# Altium project DynamicComplexModulo_v1i1.PrjPCB
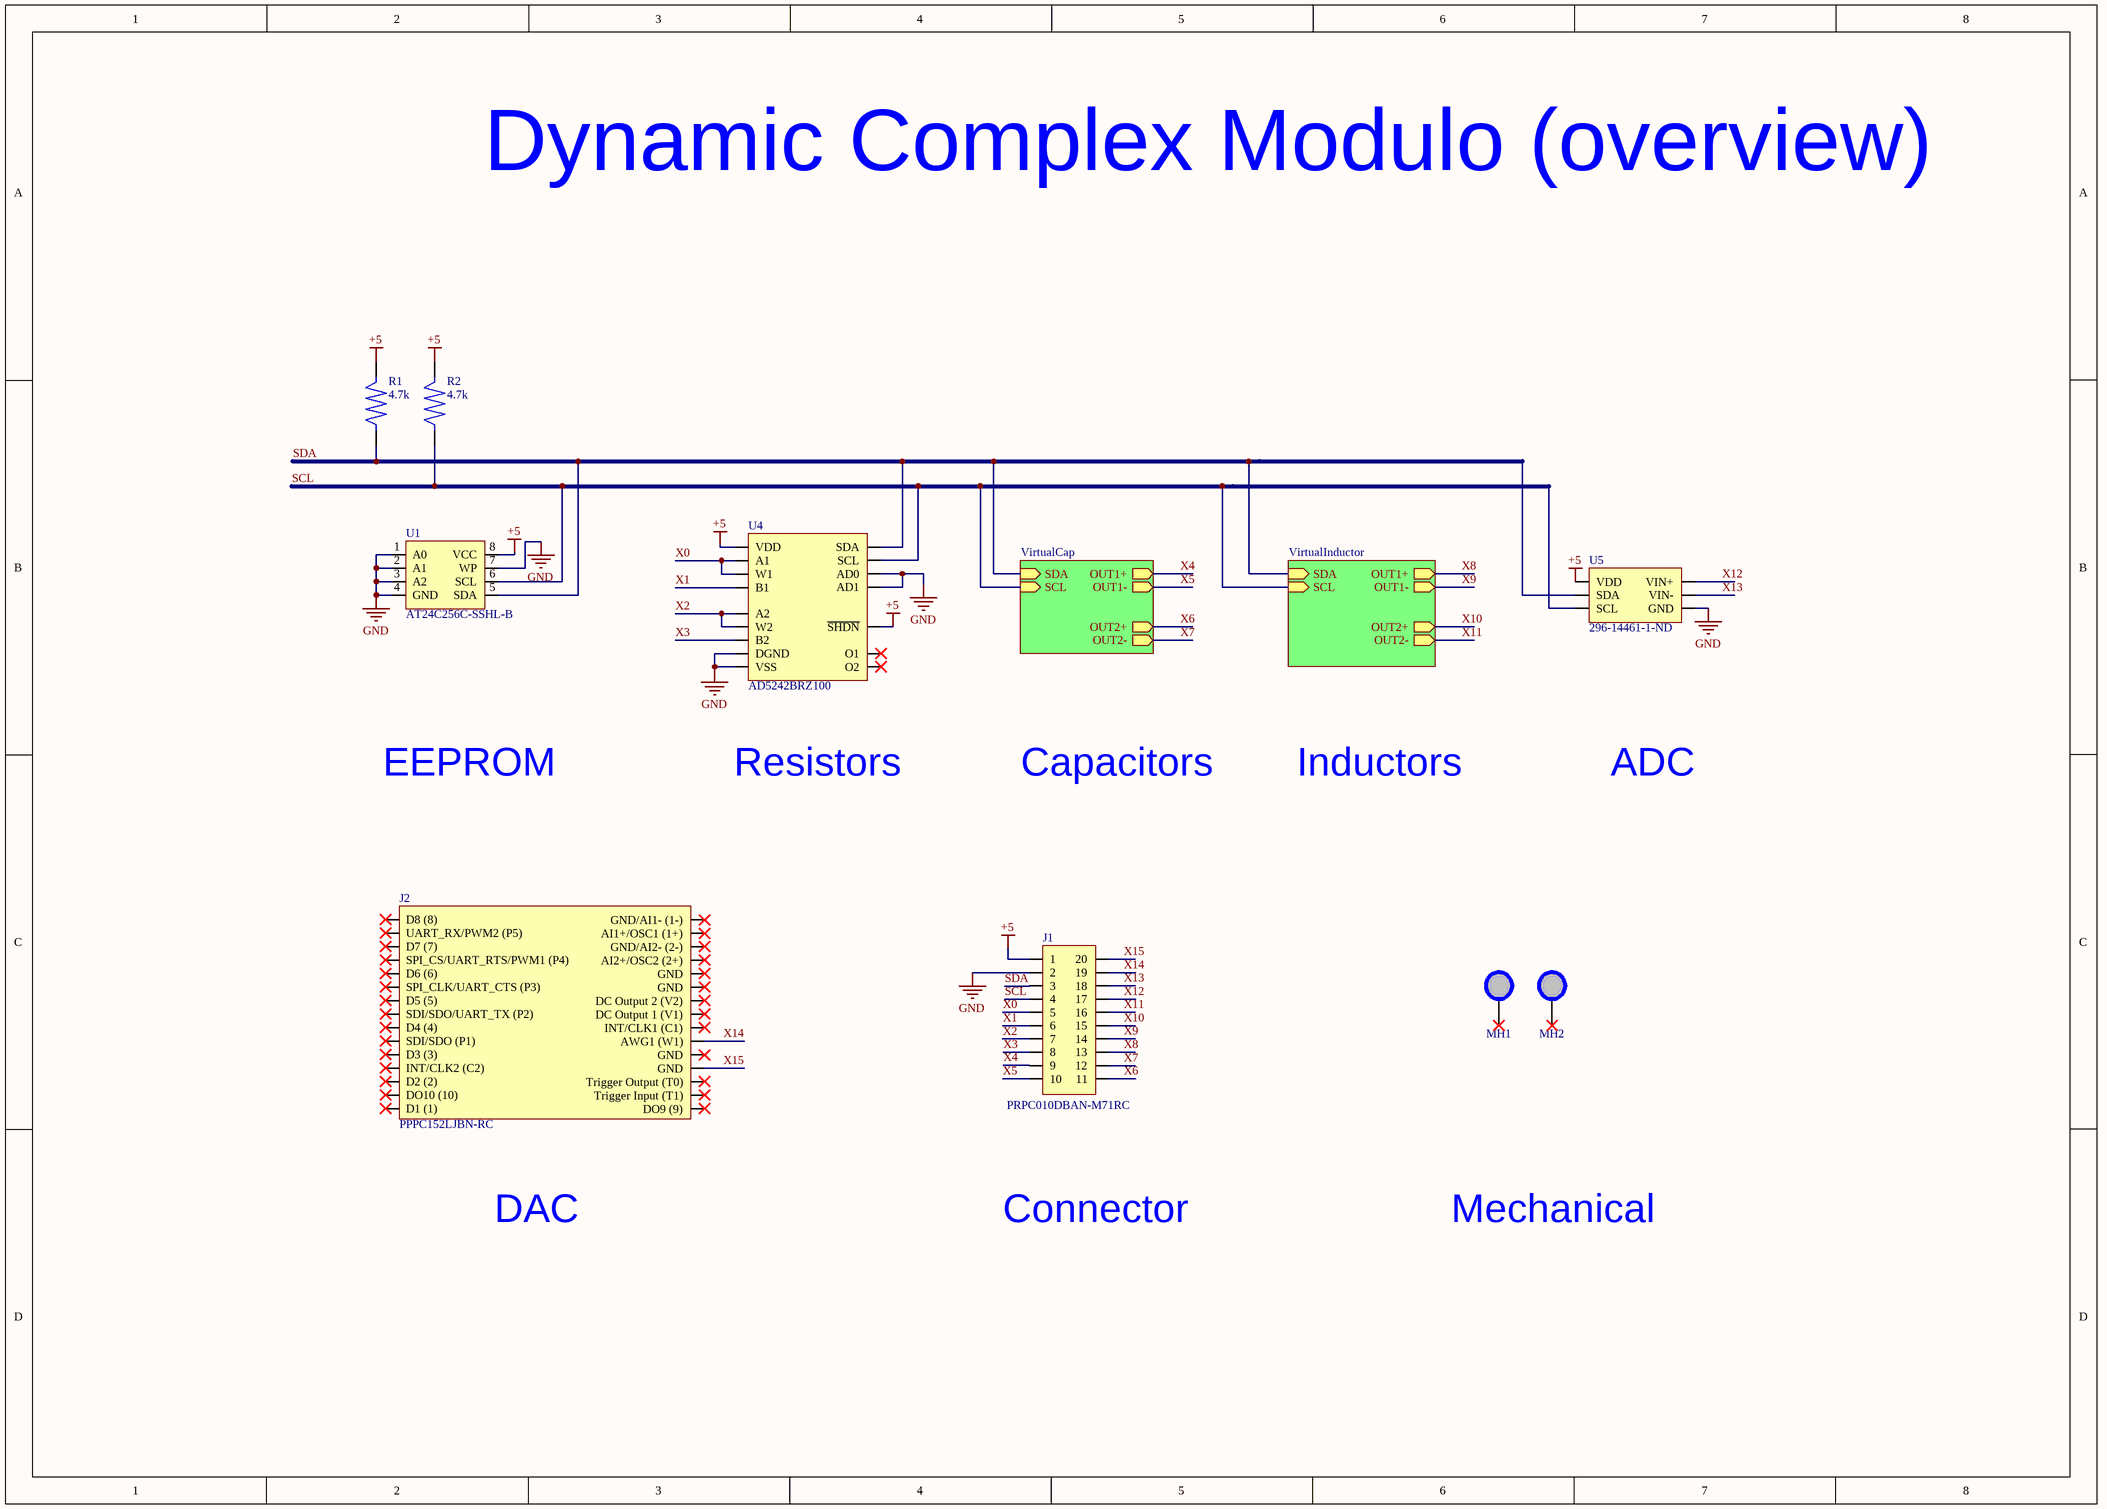
[diagram p0: DynamicComplexModulo_v1i1.SchDoc]
3 sheets, 45 parts. Net scope: hierarchical (ports join the sheet entries above them; power ports are global).
Board file: DynamicComplexModulo_v1i1.PcbDoc
Sheets:
  DynamicComplexModulo_v1i1.SchDoc
    VirtualCap = CapacitorLadder.SchDoc
    VirtualInductor = InductorLadder.SchDoc

## Sheet DynamicComplexModulo_v1i1.SchDoc
size A3

### Parts
J1  PRPC010DBAN-M71RC  [HDR_MALE_10x2x2.54]
J2  PPPC152LJBN-RC  [HDR_FEMALE_15x2x2.54]
MH1  MH 3.2mm NP  [MH3.2mm]  (value not drawn)  (no BOM)
MH2  MH 3.2mm NP  [MH3.2mm]  (value not drawn)  (no BOM)
R1  4.7k  [R0805]
R2  4.7k  [R0805]
U1  AT24C256C-SSHL-B  [AT24C256C-SSHL-B]
U4  AD5242BRZ100  [AD5242BRZ100]
U5  296-14461-1-ND  [SOT23-6]

### Sub-sheets
VirtualCap = CapacitorLadder.SchDoc: OUT1+ (out), OUT1- (out), OUT2+ (out), OUT2- (out), SDA (in), SCL (in)
VirtualInductor = InductorLadder.SchDoc: OUT1+ (out), OUT1- (out), OUT2+ (out), SDA (in), SCL (in), OUT2- (out)

### Nets
+5: J1.1 R1.2 R2.2 U1.8(VCC) U4.5(VDD) U4.6(~{SHDN}) U5.5(VDD)
GND: J1.2 U1.1(A0) U1.2(A1) U1.3(A2) U1.4(GND) U1.7(WP) U4.9(AD0) U4.10(AD1) U4.11(DGND) U4.12(VSS) U5.2(GND)
SCL: J1.4 R2.1 U1.6(SCL) U4.7(SCL) U5.3(SCL) ; sheet VirtualCap/SCL, sheet VirtualInductor/SCL
SDA: J1.3 R1.1 U1.5(SDA) U4.8(SDA) U5.4(SDA) ; sheet VirtualCap/SDA, sheet VirtualInductor/SDA
X0: J1.5 U4.2(A1) U4.3(W1)
X1: J1.6 U4.4(B1)
X2: J1.7 U4.15(W2) U4.16(A2)
X3: J1.8 U4.14(B2)
X4: J1.9 ; sheet VirtualCap/OUT1+
X5: J1.10 ; sheet VirtualCap/OUT1-
X6: J1.11 ; sheet VirtualCap/OUT2+
X7: J1.12 ; sheet VirtualCap/OUT2-
X8: J1.13 ; sheet VirtualInductor/OUT1+
X9: J1.14 ; sheet VirtualInductor/OUT1-
X10: J1.15 ; sheet VirtualInductor/OUT2+
X11: J1.16 ; sheet VirtualInductor/OUT2-
X12: J1.17 U5.1(VIN+)
X13: J1.18 U5.6(VIN-)
X14: J1.19 J2.21(AWG1_(W1))
X15: J1.20 J2.19(GND)

Not connected (* = marked no-connect by the designer): J2 1(D8_(8))* 2(UART_RX/PWM2_(P5))* 3(D7_(7))* 4(SPI_CS/UART_RTS/PWM1_(P4))* 5(D6_(6))* 6(SPI_CLK/UART_CTS_(P3))* 7(D5_(5))* 8(SDI/SDO/UART_TX_(P2))* 9(D4_(4))* 10(SDI/SDO_(P1))* 11(D3_(3))* 12(INT/CLK2_(C2))* 13(D2_(2))* 14(DO10_(10))* 15(D1_(1))* 16(DO9_(9))* 17(Trigger_Input_(T1))* 18(Trigger_Output_(T0))* 20(GND)* 22(INT/CLK1_(C1))* 23(DC_Output_1_(V1))* 24(DC_Output_2_(V2))* 25(GND)* 26(GND)* 27(AI2+/OSC2_(2+))* 28(GND/AI2-_(2-))* 29(AI1+/OSC1_(1+))* 30(GND/AI1-_(1-))*; MH1 1*; MH2 1*; U4 1(O1)* 13(O2)*

### Notes on the sheet
- Dynamic Complex Modulo (overview)
- EEPROM
- Resistors
- Capacitors
- Inductors
- ADC
- DAC
- Connector
- Mechanical

### Library data of the parts
J1 = HDR Male 2x10_2.54: 20 Positions Header, Unshrouded, Breakaway Connector 0.100" (2.54mm) Through Hole, Right Angle Gold; Manufacturer: Sullins; Number of Positions: 20; Connector Type: Male Pin; Pitch: 0.1inch; Supplier 1: Digi-Key; Manufacturer Part Number: PRPC010DBAN-M71RC; Stock 1: 459; Mount: Through Hole; Colour: Black; Contact Plating: Gold; Package Quantity: 1; Number of Rows: 2; Packaging: Bulk; Termination: Solder; Row Spacing: 0.1inch; Contact Mating Length: 0.23inch; ComponentLink1URL: https://datasheet.ciiva.com/741/xrxczzzdxxn-m71rc-11639-b-741675.pdf; ComponentLink1Description: https://datasheet.ciiva.com/741/xrxczzzdxxn-m71rc-11639-b-741675.pdf; Supplier Part Number 1: S2111EC-10-ND; Pricing 1: 1=1.08, 10=0.97, 100=0.7989, 500=0.6315, 1000=0.5421, 5000=0.49455, 10000=0.47553 (USD); System: Connector
J2 = OPENSCOPE_CONNECTOR: CONN FMALE 30POS DL .1" R/A GOLD; Manufacturer: Sullins; Number of Positions: 30; Connector Type: Socket,Header; Pitch: 0.1inch; Supplier 1: Digi-Key; Manufacturer Part Number: PPPC152LJBN-RC; Stock 1: 2029; Mount: Through Hole; Colour: Black; Contact Plating: Gold; Contact Material: Bronze; Housing Colour: Black; Housing Material: Plastic; Package Quantity: 1000; Number of Rows: 2; Packaging: Bulk; Termination: Solder; Length: 38.6mm; Height: 5mm; Row Spacing: 0.1inch; Width: 8.5mm; Lead Free: Lead Free; ComponentLink1URL: http://sullinscorp.com/drawings/101_P(N)PxCxx2LJBN-RC,_10494-H.pdf; ComponentLink1Description: http://sullinscorp.com/drawings/101_P(N)PxCxx2LJBN-RC,_10494-H.pdf; Supplier Part Number 1: S5568-ND; Pricing 1: 1=2.22, 10=2.018, 100=1.7294, 500=1.44112, 1000=1.23525, 5000=1.1895 (USD)
MH1 MH2 = MHNP: Mounting hole 3.2mm non plated
R1 R2 = R0805_4.7k
U1 = AT24C256C-SSHL-B: ATMEL         AT24C256C-SSHL-B            EEPROM, 256 Kbit, 32K x 8bit, 1 MHz, Serial, SOIC, 8 Pins; Manufacturer: Microchip / Atmel; Interface: I2C,Serial,2-Wire; Min Supply Voltage: 1.7V; Max Supply Voltage: 5.5V; Access Time: 550ns; Number of Words: 32768; Density: 256Kb; Frequency: 1MHz; Nominal Supply Current: 3mA; Voltage: 5V; Supplier 1: Digi-Key; Manufacturer Part Number: AT24C256C-SSHL-B; Stock 1: 4655; Mount: Surface Mount; Case/Package: SOIC; Number of Pins: 8; Contact Plating: Tin,Matte; Min Operating Temperature: -40°C; Max Operating Temperature: 85°C; Packaging: Bulk; Package Quantity: 100; Memory Type: EEPROM; Memory Size: 256Kb; Max Frequency: 1MHz; Length: 5.05mm; Height: 1.5mm; Width: 3.99mm; Radiation Hardening: No; REACH SVHC: No SVHC; ComponentLink1URL: https://datasheet.ciiva.com/15123/getdatasheetpartid-367456-15123424.pdf; ComponentLink1Description: https://datasheet.ciiva.com/15123/getdatasheetpartid-367456-15123424.pdf; ComponentLink2URL: https://datasheet.ciiva.com/15123/getdatasheetpartid-304516-15123348.pdf; ComponentLink2Description: https://datasheet.ciiva.com/15123/getdatasheetpartid-304516-15123348.pdf; ComponentLink3URL: https://datasheet.ciiva.com/1910/atmel-8568-seeprom-at24c256c-datasheet-1910422.pdf; ComponentLink3Description: https://datasheet.ciiva.com/1910/atmel-8568-seeprom-at24c256c-datasheet-1910422.pdf; ComponentLink4URL: https://datasheet.ciiva.com/1509/1726561-1509879.pdf; ComponentLink4Description: https://datasheet.ciiva.com/1509/1726561-1509879.pdf; Supplier Part Number 1: AT24C256C-SSHL-B-ND; Pricing 1: 1=0.68, 10=0.619, 25=0.6108, 100=0.543 (USD)
U4 = AD5242BRZ100-REEL7: IC POT DGTL DUAL 256POS 16SOIC; Manufacturer: Analog Devices; Resistance: 100kR; Interface: I2C; Max Supply Voltage: 5.5V; Min Supply Voltage: 2.7V; Min Dual Supply Voltage: 2.3V; Tolerance: 50%; Nominal Supply Current: 100nA; Dual Supply Voltage: 2.5V; Number of Circuits: 2; Number of Taps: 256; Memory Type: Volatile; Temperature Coefficient: 30ppm/°C; Frequency: 400kHz; -3db Bandwidth: 650kHz; Supplier 1: Digi-Key; Manufacturer Part Number: AD5242BRZ100-REEL7; Stock 1: 881; Mount: Surface Mount; Case/Package: SOIC; Number of Pins: 16; Contact Plating: Tin,Matte; Min Operating Temperature: -40°C; Max Operating Temperature: 105°C; Packaging: Tape and Reel; Max Dual Supply Voltage: 2.7V; Package Quantity: 1000; Taper: Linear; Operating Supply Current: 100nA; Number of Positions: 256; Number of Elements: 2; Max Supply Current: 100nA; Quiescent Current: 100nA; Lead Free: Contains Lead; ComponentLink1URL: https://datasheet.ciiva.com/3046/ad5241-5242-3046354.pdf; ComponentLink1Description: https://datasheet.ciiva.com/3046/ad5241-5242-3046354.pdf; ComponentLink2URL: https://datasheet.ciiva.com/1339/ad5241-5242-1339036.pdf; ComponentLink2Description: https://datasheet.ciiva.com/1339/ad5241-5242-1339036.pdf
U5 = ADS1110A7IDBVT: IC ADC 16-BIT I2C PROGBL SOT23-6; Manufacturer: Texas Instruments; Min Supply Voltage: 2.7V; Max Supply Voltage: 5.5V; Number of Channels: 1; Max Power Dissipation: 1.75mW; Operating Supply Voltage: 5V; Number of Bits: 16; Sampling Rate: 0.128KS/s; Resolution: 16b; Polarity: Bipolar,Unipolar; Differential Nonlinearity: 1LSB; Conversion Rate: 128S/s; Nominal Supply Current: 240uA; Supply Type: Single; Supplier 1: Digi-Key; Manufacturer Part Number: ADS1110A7IDBVT; Stock 1: 469; Case/Package: SOT-23-6; Number of Pins: 6; Contact Plating: Gold; Min Operating Temperature: -40°C; Max Operating Temperature: 125°C; Packaging: Tape and Reel; Package Quantity: 250; Interface: I2C; Number of Inputs: 1; Number of A/D Converters: 1; Number of Converters: 1; Number of Elements: 1; Power Dissipation: 1.75mW; Number of Analog Inputs: 1; Radiation Hardening: No; Lead Free: Lead Free; ComponentLink1URL: https://datasheet.ciiva.com/25993/ads1110-25993414.pdf; ComponentLink1Description: https://datasheet.ciiva.com/25993/ads1110-25993414.pdf; ComponentLink2URL: https://datasheet.ciiva.com/1262/ads1110-1262313.pdf; ComponentLink2Description: https://datasheet.ciiva.com/1262/ads1110-1262313.pdf; ComponentLink3URL: https://datasheet.ciiva.com/1262/ads1110-1262314.pdf; ComponentLink3Description: https://datasheet.ciiva.com/1262/ads1110-1262314.pdf; ComponentLink4URL: https://datasheet.ciiva.com/1262/ads1110-1262315.pdf; ComponentLink4Description: https://datasheet.ciiva.com/1262/ads1110-1262315.pdf; ComponentLink5URL: https://datasheet.ciiva.com/14260/sbas276a-14260046.pdf; ComponentLink5Description: https://datasheet.ciiva.com/14260/sbas276a-14260046.pdf; ComponentLink6URL: https://datasheet.ciiva.com/26800/ads1110a7idbvt-26800806.pdf; ComponentLink6Description: https://datasheet.ciiva.com/26800/ads1110a7idbvt-26800806.pdf; ComponentLink7URL: https://datasheet.ciiva.com/41461/001186690-da-01-en-ic-adc-16-bi-ads1110a7idbvt-sot-23-6-tid-41461014.pdf; ComponentLink7Description: https://datasheet.ciiva.com/41461/001186690-da-01-en-ic-adc-16-bi-ads1110a7idbvt-sot-23-6-tid-41461014.pdf; Supplier Part Number 1: 296-14468-6-ND; Pricing 1: 1=6.46, 10=5.805, 100=4.7561 (USD); Mount: Surface Mount

## Sheet CapacitorLadder.SchDoc
size A4
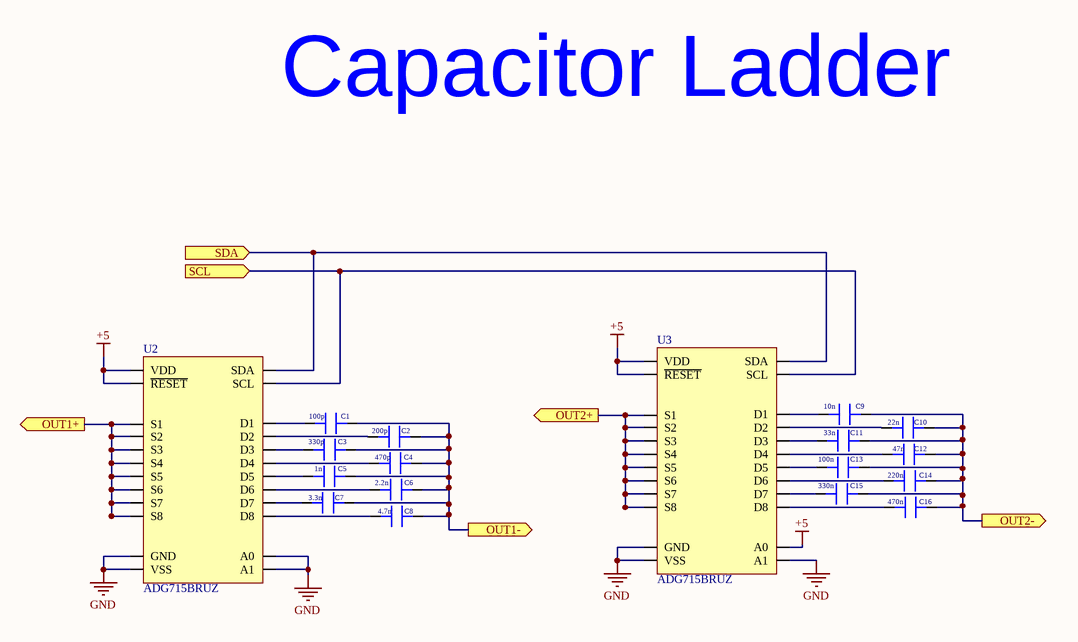
[diagram p1: CapacitorLadder.SchDoc]

### Parts
C1  100p  [C0805]
C2  200p  [C0805]
C3  330p  [C0805]
C4  470p  [C0805]
C5  1n  [C0805]
C6  2.2n  [C0805]
C7  3.3n  [C0805]
C8  4.7n  [C0805]
C9  10n  [C0805]
C10  22n  [C0805]
C11  33n  [C0805]
C12  47n  [C0805]
C13  100n  [C0805]
C14  220n  [C0805]
C15  330n  [C0805]
C16  470n  [C0805]
U2  ADG715BRUZ  [ADG715BRUZ]
U3  ADG715BRUZ  [ADG715BRUZ]

### Ports
OUT1+ (out), OUT1- (out), OUT2+ (out), OUT2- (out), SCL (in), SDA (in)

### Nets
+5: U2.2(VDD) U2.23(~{RESET}) U3.2(VDD) U3.23(~{RESET}) U3.24(A0)
GND: U2.4(GND) U2.21(VSS) U2.22(A1) U2.24(A0) U3.4(GND) U3.21(VSS) U3.22(A1)
SCL: U2.1(SCL) U3.1(SCL) ; port SCL
SDA: U2.3(SDA) U3.3(SDA) ; port SDA
X4: U2.5(S1) U2.7(S2) U2.9(S3) U2.11(S4) U2.14(S5) U2.16(S6) U2.18(S7) U2.20(S8) ; port OUT1+
X5: C1.2 C2.2 C3.2 C4.2 C5.2 C6.2 C7.2 C8.2 ; port OUT1-
X6: U3.5(S1) U3.7(S2) U3.9(S3) U3.11(S4) U3.14(S5) U3.16(S6) U3.18(S7) U3.20(S8) ; port OUT2+
X7: C9.2 C10.2 C11.2 C12.2 C13.2 C14.2 C15.2 C16.2 ; port OUT2-
NetC1_1: C1.1 U2.6(D1)
NetC2_1: C2.1 U2.8(D2)
NetC3_1: C3.1 U2.10(D3)
NetC4_1: C4.1 U2.12(D4)
NetC5_1: C5.1 U2.13(D5)
NetC6_1: C6.1 U2.15(D6)
NetC7_1: C7.1 U2.17(D7)
NetC8_1: C8.1 U2.19(D8)
NetC9_1: C9.1 U3.6(D1)
NetC10_1: C10.1 U3.8(D2)
NetC11_1: C11.1 U3.10(D3)
NetC12_1: C12.1 U3.12(D4)
NetC13_1: C13.1 U3.13(D5)
NetC14_1: C14.1 U3.15(D6)
NetC15_1: C15.1 U3.17(D7)
NetC16_1: C16.1 U3.19(D8)

### Notes on the sheet
- Capacitor Ladder
- Title
- Size:
- Date:
- A4
- Number:
- Time:
- Revision:
- Sheet
- of
- File:

### Library data of the parts
C1 = C805_100p
C2 = C805_200p
C3 = C805_330p
C4 = C805_470p
C5 = C805_1n
C6 = C805_2.2n
C7 = C805_3.3n
C8 = C805_4.7n
C9 = C805_10n
C10 = C805_22n
C11 = C805_33n
C12 = C805_47n
C13 = C805_100n
C14 = C805_220n
C15 = C805_330n
C16 = C805_470n
U2 U3 = ADG715BRUZ: ANALOG DEVICES         ADG715BRUZ            Analogue Switch, Octal Channel, SPST, 8 Channels, 4.5 ohm, 2.7V to 5.5V, TSSOP, 24 Pins; Number of Channels: 8; Bandwidth: 155MHz; Drain to Source Resistance: 2.5R; Nominal Supply Current: 20uA; Max Power Dissipation: 125uW; Interface: Serial; Dual Supply Voltage: 2.5V; On-State Resistance: 4.5R; Turn-On Delay Time: 140ns; Turn-Off Delay Time: 130ns; Operating Supply Current: 10uA; High Level Output Current: 30mA; Supply Type: Single,Dual; Max Dual Supply Voltage: 2.75V; Min Dual Supply Voltage: 2.25V; Supplier 1: Digi-Key; Manufacturer: Analog Devices; Manufacturer Part Number: ADG715BRUZ; Stock 1: 3027; Case/Package: TSSOP; Number of Pins: 24; Contact Plating: Tin,Matte; Min Operating Temperature: -40°C; Max Operating Temperature: 85°C; Throw Configuration: SPST; Number of Bits: 8; Min Supply Voltage: 2.7V; Max Supply Voltage: 5.5V; Number of Inputs: 8; Number of Outputs: 8; Package Quantity: 62; Packaging: Rail/Tube; Number of Circuits: 8; -3db Bandwidth: 155MHz; Max Supply Current: 20uA; Power Dissipation: 125uW; Length: 7.8mm; Height: 1.05mm; Width: 4.4mm; Radiation Hardening: No; REACH SVHC: No SVHC; Lead Free: Contains Lead; ComponentLink1URL: https://datasheet.ciiva.com/2978/adg714-715-2978656.pdf; ComponentLink1Description: https://datasheet.ciiva.com/2978/adg714-715-2978656.pdf; ComponentLink2URL: https://datasheet.ciiva.com/1668/adg714-715-1668978.pdf; ComponentLink2Description: https://datasheet.ciiva.com/1668/adg714-715-1668978.pdf; ComponentLink3URL: https://datasheet.ciiva.com/15127/getdatasheetpartid-123058-15127194.pdf; ComponentLink3Description: https://datasheet.ciiva.com/15127/getdatasheetpartid-123058-15127194.pdf; ComponentLink4URL: https://datasheet.ciiva.com/16637/adg714-715-16637994.pdf; ComponentLink4Description: https://datasheet.ciiva.com/16637/adg714-715-16637994.pdf; ComponentLink5URL: https://datasheet.ciiva.com/5797/adg714-715-5797179.pdf; ComponentLink5Description: https://datasheet.ciiva.com/5797/adg714-715-5797179.pdf; ComponentLink6URL: https://datasheet.ciiva.com/48708/001248020-da-01-en-ic-switch-octal-adg715bruz-tssop-24-adi-48708535.pdf; ComponentLink6Description: https://datasheet.ciiva.com/48708/001248020-da-01-en-ic-switch-octal-adg715bruz-tssop-24-adi-48708535.pdf; Supplier Part Number 1: ADG715BRUZ-ND; Pricing 1: 1=6.12, 62=5.19758, 124=4.50452, 558=3.83461, 1054=3.234 (USD)

## Sheet InductorLadder.SchDoc
size A4
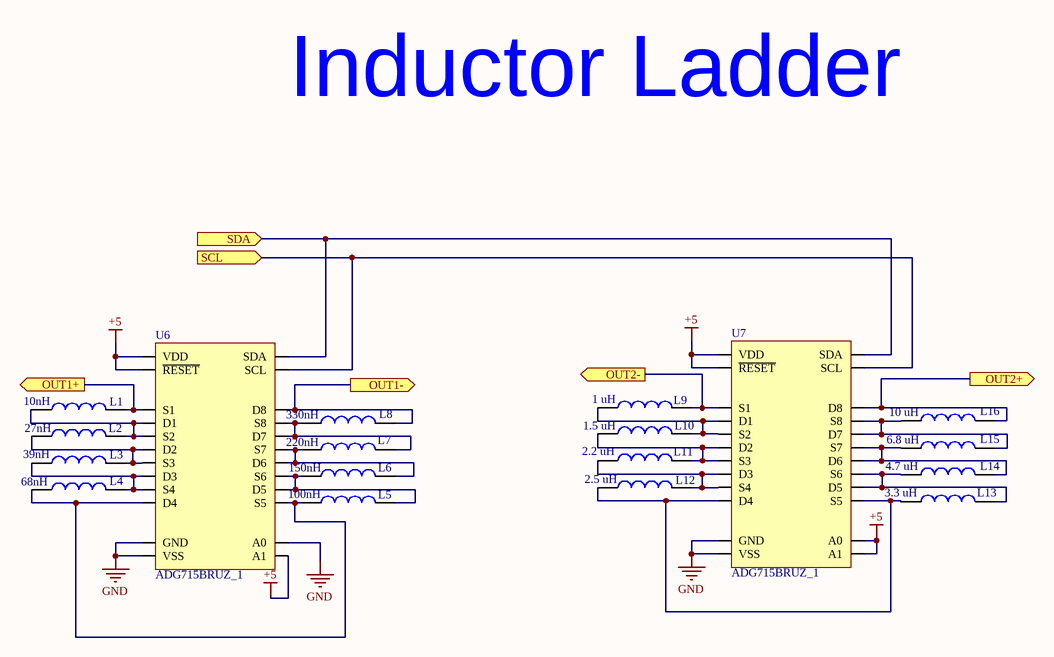
[diagram p2: InductorLadder.SchDoc]

### Parts
L1  value 10nH  [WE-KI_1008A]  (hidden comment: WE-KI, 744762110A)
L2  value 27nH  [WE-KI_1008A]  (hidden comment: WE-KI, 744762127A)
L3  value 39nH  [WE-KI_1008A]  (hidden comment: WE-KI, 744762139A)
L4  value 68nH  [WE-KI_1008A]  (hidden comment: WE-KI, 744762168A)
L5  value 100nH  [WE-KI_1008A]  (hidden comment: WE-KI, 744762210A)
L6  value 150nH  [WE-KI_1008A]  (hidden comment: WE-KI, 744762215A)
L7  value 220nH  [WE-KI_1008A]  (hidden comment: WE-KI, 744762222A)
L8  value 330nH  [WE-KI_1008A]  (hidden comment: WE-KI, 744762233A)
L9  1 uH  [WE-LQS_2010]
L10  1.5 uH  [WE-LQS_2010]
L11  2.2 uH  [WE-LQS_2010]
L12  2.5 uH  [WE-LQS_2010]
L13  3.3 uH  [WE-LQS_2010]
L14  4.7 uH  [WE-LQS_2010]
L15  6.8 uH  [WE-LQS_2010]
L16  10 uH  [WE-LQS_2010]
U6  ADG715BRUZ_1  [ADG715BRUZ]
U7  ADG715BRUZ_1  [ADG715BRUZ]

### Ports
OUT1+ (out), OUT1- (out), OUT2+ (out), OUT2- (out), SCL (in), SDA (in)

### Nets
+5: U6.2(VDD) U6.22(A1) U6.23(~{RESET}) U7.2(VDD) U7.22(A1) U7.23(~{RESET}) U7.24(A0)
GND: U6.4(GND) U6.21(VSS) U6.24(A0) U7.4(GND) U7.21(VSS)
SCL: U6.1(SCL) U7.1(SCL) ; port SCL
SDA: U6.3(SDA) U7.3(SDA) ; port SDA
X8: L1.2 U6.5(S1) ; port OUT1+
X9: L8.2 U6.19(D8) ; port OUT1-
X10: L16.2 U7.19(D8) ; port OUT2+
X11: L9.2 U7.5(S1) ; port OUT2-
NetL1_1: L1.1 L2.2 U6.6(D1) U6.7(S2)
NetL2_1: L2.1 L3.2 U6.8(D2) U6.9(S3)
NetL3_1: L3.1 L4.2 U6.10(D3) U6.11(S4)
NetL4_1: L4.1 L5.1 U6.12(D4) U6.14(S5)
NetL5_2: L5.2 L6.1 U6.13(D5) U6.16(S6)
NetL6_2: L6.2 L7.1 U6.15(D6) U6.18(S7)
NetL7_2: L7.2 L8.1 U6.17(D7) U6.20(S8)
NetL9_1: L9.1 L10.2 U7.6(D1) U7.7(S2)
NetL10_1: L10.1 L11.2 U7.8(D2) U7.9(S3)
NetL11_1: L11.1 L12.2 U7.10(D3) U7.11(S4)
NetL12_1: L12.1 L13.1 U7.12(D4) U7.14(S5)
NetL13_2: L13.2 L14.1 U7.13(D5) U7.16(S6)
NetL14_2: L14.2 L15.1 U7.15(D6) U7.18(S7)
NetL15_2: L15.2 L16.1 U7.17(D7) U7.20(S8)

### Notes on the sheet
- Inductor Ladder
- Title
- Size:
- Date:
- A4
- Number:
- Time:
- Revision:
- Sheet
- of
- File:

### Library data of the parts
L1 = WE-KI, 744762110A: WE-KI SMD Wire Wound Ceramic Inductor, size 1008A, 10nH; PublishedDate: Sep. 2016; Publisher: Wurth Elektronik; ComponentLink1Description: Manufacturer; ComponentLink1URL: http://www.we-online.de; ComponentLink2Description: Datasheet; ComponentLink2URL: http://katalog.we-online.de/pbs/datasheet/744762110A.pdf; PartNumber: 744762110A; Size: 1008A; Supplier 1: Digi-Key; Supplier Part Number 1: 732-1808-6-ND
L2 = WE-KI, 744762127A: WE-KI SMD Wire Wound Ceramic Inductor, size 1008A, 27nH; PublishedDate: Sep. 2016; Publisher: Wurth Elektronik; ComponentLink1Description: Manufacturer; ComponentLink1URL: http://www.we-online.de; ComponentLink2Description: Datasheet; ComponentLink2URL: http://katalog.we-online.de/pbs/datasheet/744762127A.pdf; PartNumber: 744762127A; Size: 1008A; Supplier 1: Digi-Key; Supplier Part Number 1: 732-1813-6-ND
L3 = WE-KI, 744762139A: WE-KI SMD Wire Wound Ceramic Inductor, size 1008A, 39nH; PublishedDate: Sep. 2016; Publisher: Wurth Elektronik; ComponentLink1Description: Manufacturer; ComponentLink1URL: http://www.we-online.de; ComponentLink2Description: Datasheet; ComponentLink2URL: http://katalog.we-online.de/pbs/datasheet/744762139A.pdf; PartNumber: 744762139A; Size: 1008A; Supplier 1: Digi-Key; Supplier Part Number 1: 732-1815-6-ND
L4 = WE-KI, 744762168A: WE-KI SMD Wire Wound Ceramic Inductor, size 1008A, 68nH; PublishedDate: Sep. 2016; Publisher: Wurth Elektronik; ComponentLink1Description: Manufacturer; ComponentLink1URL: http://www.we-online.de; ComponentLink2Description: Datasheet; ComponentLink2URL: http://katalog.we-online.de/pbs/datasheet/744762168A.pdf; PartNumber: 744762168A; Size: 1008A; Supplier 1: Digi-Key; Supplier Part Number 1: 732-1818-6-ND
L5 = WE-KI, 744762210A: WE-KI SMD Wire Wound Ceramic Inductor, size 1008A, 100nH; PublishedDate: Sep. 2016; Publisher: Wurth Elektronik; ComponentLink1Description: Manufacturer; ComponentLink1URL: http://www.we-online.de; ComponentLink2Description: Datasheet; ComponentLink2URL: http://katalog.we-online.de/pbs/datasheet/744762210A.pdf; PartNumber: 744762210A; Size: 1008A; Supplier 1: Digi-Key; Supplier Part Number 1: 732-1820-6-ND
L6 = WE-KI, 744762215A: WE-KI SMD Wire Wound Ceramic Inductor, size 1008A, 150nH; PublishedDate: Sep. 2016; Publisher: Wurth Elektronik; ComponentLink1Description: Manufacturer; ComponentLink1URL: http://www.we-online.de; ComponentLink2Description: Datasheet; ComponentLink2URL: http://katalog.we-online.de/pbs/datasheet/744762215A.pdf; PartNumber: 744762215A; Size: 1008A; Supplier 1: Digi-Key; Supplier Part Number 1: 732-1822-6-ND
L7 = WE-KI, 744762222A: WE-KI SMD Wire Wound Ceramic Inductor, size 1008A, 220nH; PublishedDate: Sep. 2016; Publisher: Wurth Elektronik; ComponentLink1Description: Manufacturer; ComponentLink1URL: http://www.we-online.de; ComponentLink2Description: Datasheet; ComponentLink2URL: http://katalog.we-online.de/pbs/datasheet/744762222A.pdf; PartNumber: 744762222A; Size: 1008A; Supplier 1: Digi-Key; Supplier Part Number 1: 732-1824-6-ND
L8 = WE-KI, 744762233A: WE-KI SMD Wire Wound Ceramic Inductor, size 1008A, 330nH; PublishedDate: Sep. 2016; Publisher: Wurth Elektronik; ComponentLink1Description: Manufacturer; ComponentLink1URL: http://www.we-online.de; ComponentLink2Description: Datasheet; ComponentLink2URL: http://katalog.we-online.de/pbs/datasheet/744762233A.pdf; PartNumber: 744762233A; Size: 1008A; Supplier 1: Digi-Key; Supplier Part Number 1: 732-1826-6-ND
L9 = 74404020010: WE-LQS SMD Power Inductor, size 2010, 1 uH, 1.49 A; Manufacturer: Wurth Electronics; Rated Current max.: 1.49 A; DC Resistance: 0.095 Ohm; ComponentLink1Description: Manufacturer; ComponentLink1URL: http://www.we-online.de; ComponentLink2Description: Datasheet; ComponentLink2URL: http://katalog.we-online.de/pbs/datasheet/74404020010.pdf; Part Number: 74404020010; Published Date: Dec. 2017; Publisher: Wurth Elektronik; Size: 2010; Inductance: 1 uH; Operating Temperature: -40 to +125 degC; Supplier 1: Digi-Key; Manufacturer Part Number: 74404020010; Stock 1: 3959; Supplier Part Number 1: 732-10739-6-ND; Pricing 1: 1=0.56, 50=0.4698, 100=0.357, 1000=0.31007 (USD)
L10 = 74404020015: WE-LQS SMD Power Inductor, size 2010, 1.5 uH, 1.19 A; Manufacturer: Wurth Electronics; Rated Current max.: 1.19 A; DC Resistance: 0.145 Ohm; ComponentLink1Description: Manufacturer; ComponentLink1URL: http://www.we-online.de; ComponentLink2Description: Datasheet; ComponentLink2URL: http://katalog.we-online.de/pbs/datasheet/74404020015.pdf; Part Number: 74404020015; Published Date: Dec. 2017; Publisher: Wurth Elektronik; Size: 2010; Inductance: 1.5 uH; Operating Temperature: -40 to +125 degC; Supplier 1: Digi-Key; Manufacturer Part Number: 74404020015; Stock 1: 3931; Supplier Part Number 1: 732-10740-6-ND; Pricing 1: 1=0.56, 50=0.4698, 100=0.357, 1000=0.31007 (USD)
L11 = 74404020022: WE-LQS SMD Power Inductor, size 2010, 2.2 uH, 0.96 A; Manufacturer: Wurth Electronics; Rated Current max.: 0.96 A; DC Resistance: 0.22 Ohm; ComponentLink1Description: Manufacturer; ComponentLink1URL: http://www.we-online.de; ComponentLink2Description: Datasheet; ComponentLink2URL: http://katalog.we-online.de/pbs/datasheet/74404020022.pdf; Part Number: 74404020022; Published Date: Dec. 2017; Publisher: Wurth Elektronik; Size: 2010; Inductance: 2.2 uH; Operating Temperature: -40 to +125 degC; Supplier 1: Digi-Key; Manufacturer Part Number: 74404020022; Stock 1: 3236; Supplier Part Number 1: 732-10741-6-ND; Pricing 1: 1=0.56, 50=0.4698, 100=0.357, 1000=0.31007 (USD)
L12 = 74405020022: WE-LQS SMD Power Inductor, size 2010, 2.5 uH, 0.96 A; Part Number: 74404020022; Manufacturer: Wurth Electronics; Rated Current max.: 0.96 A; Inductance: 2.2 uH; DC Resistance: 0.22 Ohm; ComponentLink1Description: Manufacturer; ComponentLink1URL: http://www.we-online.de; ComponentLink2Description: Datasheet; ComponentLink2URL: http://katalog.we-online.de/pbs/datasheet/74404020022.pdf; Published Date: Dec. 2017; Publisher: Wurth Elektronik; Size: 2010; Operating Temperature: -40 to +125 degC; Manufacturer Part Number: 74404020022; Supplier 1: Digi-Key; Stock 1: 4000; Supplier Part Number 1: 732-10770-6-ND; Pricing 1: 1=0.63, 50=0.522, 100=0.3967, 1000=0.34451 (USD)
L13 = 74404020033: WE-LQS SMD Power Inductor, size 2010, 3.3 uH, 0.87 A; Manufacturer: Wurth Electronics; Rated Current max.: 0.87 A; DC Resistance: 0.279 Ohm; ComponentLink1Description: Manufacturer; ComponentLink1URL: http://www.we-online.de; ComponentLink2Description: Datasheet; ComponentLink2URL: http://katalog.we-online.de/pbs/datasheet/74404020033.pdf; Part Number: 74404020033; Published Date: Dec. 2017; Publisher: Wurth Elektronik; Size: 2010; Inductance: 3.3 uH; Operating Temperature: -40 to +125 degC; Supplier 1: Digi-Key; Manufacturer Part Number: 74404020033; Stock 1: 3787; Supplier Part Number 1: 732-10742-6-ND; Pricing 1: 1=0.56, 50=0.4698, 100=0.357, 1000=0.31007 (USD)
L14 = 74404020047: WE-LQS SMD Power Inductor, size 2010, 4.7 uH, 0.73 A; Manufacturer: Wurth Electronics; Rated Current max.: 0.73 A; DC Resistance: 0.399 Ohm; ComponentLink1Description: Manufacturer; ComponentLink1URL: http://www.we-online.de; ComponentLink2Description: Datasheet; ComponentLink2URL: http://katalog.we-online.de/pbs/datasheet/74404020047.pdf; Part Number: 74404020047; Published Date: Dec. 2017; Publisher: Wurth Elektronik; Size: 2010; Inductance: 4.7 uH; Operating Temperature: -40 to +125 degC; Supplier 1: Digi-Key; Manufacturer Part Number: 74404020047; Stock 1: 3398; Supplier Part Number 1: 732-10743-6-ND; Pricing 1: 1=0.56, 50=0.4698, 100=0.357, 1000=0.31007 (USD)
L15 = 74404020068: WE-LQS SMD Power Inductor, size 2010, 6.8 uH, 0.56 A; Manufacturer: Wurth Electronics; Rated Current max.: 0.56 A; DC Resistance: 0.68 Ohm; ComponentLink1Description: Manufacturer; ComponentLink1URL: http://www.we-online.de; ComponentLink2Description: Datasheet; ComponentLink2URL: http://katalog.we-online.de/pbs/datasheet/74404020068.pdf; Part Number: 74404020068; Published Date: Dec. 2017; Publisher: Wurth Elektronik; Size: 2010; Inductance: 6.8 uH; Operating Temperature: -40 to +125 degC; Supplier 1: Digi-Key; Manufacturer Part Number: 74404020068; Stock 1: 3558; Supplier Part Number 1: 732-10744-6-ND; Pricing 1: 1=0.56, 50=0.4698, 100=0.357, 1000=0.31007 (USD)
L16 = 74404020100: WE-LQS SMD Power Inductor, size 2010, 10 uH, 0.5 A; Manufacturer: Wurth Electronics; Rated Current max.: 0.5 A; DC Resistance: 0.85 Ohm; ComponentLink1Description: Manufacturer; ComponentLink1URL: http://www.we-online.de; ComponentLink2Description: Datasheet; ComponentLink2URL: http://katalog.we-online.de/pbs/datasheet/74404020100.pdf; Part Number: 74404020100; Published Date: Dec. 2017; Publisher: Wurth Elektronik; Size: 2010; Inductance: 10 uH; Operating Temperature: -40 to +125 degC; Supplier 1: Digi-Key; Manufacturer Part Number: 74404020100; Stock 1: 3185; ComponentLink3URL: http://www.farnell.com/datasheets/2277209.pdf; ComponentLink3Description: http://www.farnell.com/datasheets/2277209.pdf; Supplier Part Number 1: 732-10745-6-ND; Pricing 1: 1=0.56, 50=0.4698, 100=0.357, 1000=0.31007 (USD)
U6 U7 = ADG715BRUZ_1: ANALOG DEVICES         ADG715BRUZ            Analogue Switch, Octal Channel, SPST, 8 Channels, 4.5 ohm, 2.7V to 5.5V, TSSOP, 24 Pins; Number of Channels: 8; Bandwidth: 155MHz; Drain to Source Resistance: 2.5R; Nominal Supply Current: 20uA; Max Power Dissipation: 125uW; Interface: Serial; Dual Supply Voltage: 2.5V; On-State Resistance: 4.5R; Turn-On Delay Time: 140ns; Turn-Off Delay Time: 130ns; Operating Supply Current: 10uA; High Level Output Current: 30mA; Supply Type: Single,Dual; Max Dual Supply Voltage: 2.75V; Min Dual Supply Voltage: 2.25V; Supplier 1: Digi-Key; Manufacturer: Analog Devices; Manufacturer Part Number: ADG715BRUZ; Stock 1: 3027; Case/Package: TSSOP; Number of Pins: 24; Contact Plating: Tin,Matte; Min Operating Temperature: -40°C; Max Operating Temperature: 85°C; Throw Configuration: SPST; Number of Bits: 8; Min Supply Voltage: 2.7V; Max Supply Voltage: 5.5V; Number of Inputs: 8; Number of Outputs: 8; Package Quantity: 62; Packaging: Rail/Tube; Number of Circuits: 8; -3db Bandwidth: 155MHz; Max Supply Current: 20uA; Power Dissipation: 125uW; Length: 7.8mm; Height: 1.05mm; Width: 4.4mm; Radiation Hardening: No; REACH SVHC: No SVHC; Lead Free: Contains Lead; ComponentLink1URL: https://datasheet.ciiva.com/2978/adg714-715-2978656.pdf; ComponentLink1Description: https://datasheet.ciiva.com/2978/adg714-715-2978656.pdf; ComponentLink2URL: https://datasheet.ciiva.com/1668/adg714-715-1668978.pdf; ComponentLink2Description: https://datasheet.ciiva.com/1668/adg714-715-1668978.pdf; ComponentLink3URL: https://datasheet.ciiva.com/15127/getdatasheetpartid-123058-15127194.pdf; ComponentLink3Description: https://datasheet.ciiva.com/15127/getdatasheetpartid-123058-15127194.pdf; ComponentLink4URL: https://datasheet.ciiva.com/16637/adg714-715-16637994.pdf; ComponentLink4Description: https://datasheet.ciiva.com/16637/adg714-715-16637994.pdf; ComponentLink5URL: https://datasheet.ciiva.com/5797/adg714-715-5797179.pdf; ComponentLink5Description: https://datasheet.ciiva.com/5797/adg714-715-5797179.pdf; ComponentLink6URL: https://datasheet.ciiva.com/48708/001248020-da-01-en-ic-switch-octal-adg715bruz-tssop-24-adi-48708535.pdf; ComponentLink6Description: https://datasheet.ciiva.com/48708/001248020-da-01-en-ic-switch-octal-adg715bruz-tssop-24-adi-48708535.pdf; Supplier Part Number 1: ADG715BRUZ-ND; Pricing 1: 1=6.12, 62=5.19758, 124=4.50452, 558=3.83461, 1054=3.234 (USD)

## Nets that join several sheets
+5: DynamicComplexModulo_v1i1 (7 pins), CapacitorLadder (5 pins), InductorLadder (7 pins)
GND: DynamicComplexModulo_v1i1 (11 pins), CapacitorLadder (7 pins), InductorLadder (5 pins)
SCL: DynamicComplexModulo_v1i1 (5 pins), CapacitorLadder (U2.1 U3.1), InductorLadder (U6.1 U7.1)
SDA: DynamicComplexModulo_v1i1 (5 pins), CapacitorLadder (U2.3 U3.3), InductorLadder (U6.3 U7.3)
X4: DynamicComplexModulo_v1i1 (J1.9), CapacitorLadder (8 pins)
X5: DynamicComplexModulo_v1i1 (J1.10), CapacitorLadder (8 pins)
X6: DynamicComplexModulo_v1i1 (J1.11), CapacitorLadder (8 pins)
X7: DynamicComplexModulo_v1i1 (J1.12), CapacitorLadder (8 pins)
X8: DynamicComplexModulo_v1i1 (J1.13), InductorLadder (L1.2 U6.5)
X9: DynamicComplexModulo_v1i1 (J1.14), InductorLadder (L8.2 U6.19)
X10: DynamicComplexModulo_v1i1 (J1.15), InductorLadder (L16.2 U7.19)
X11: DynamicComplexModulo_v1i1 (J1.16), InductorLadder (L9.2 U7.5)